# EAGLE schematic RHB0032E.pac (EAGLE 9.6.2)
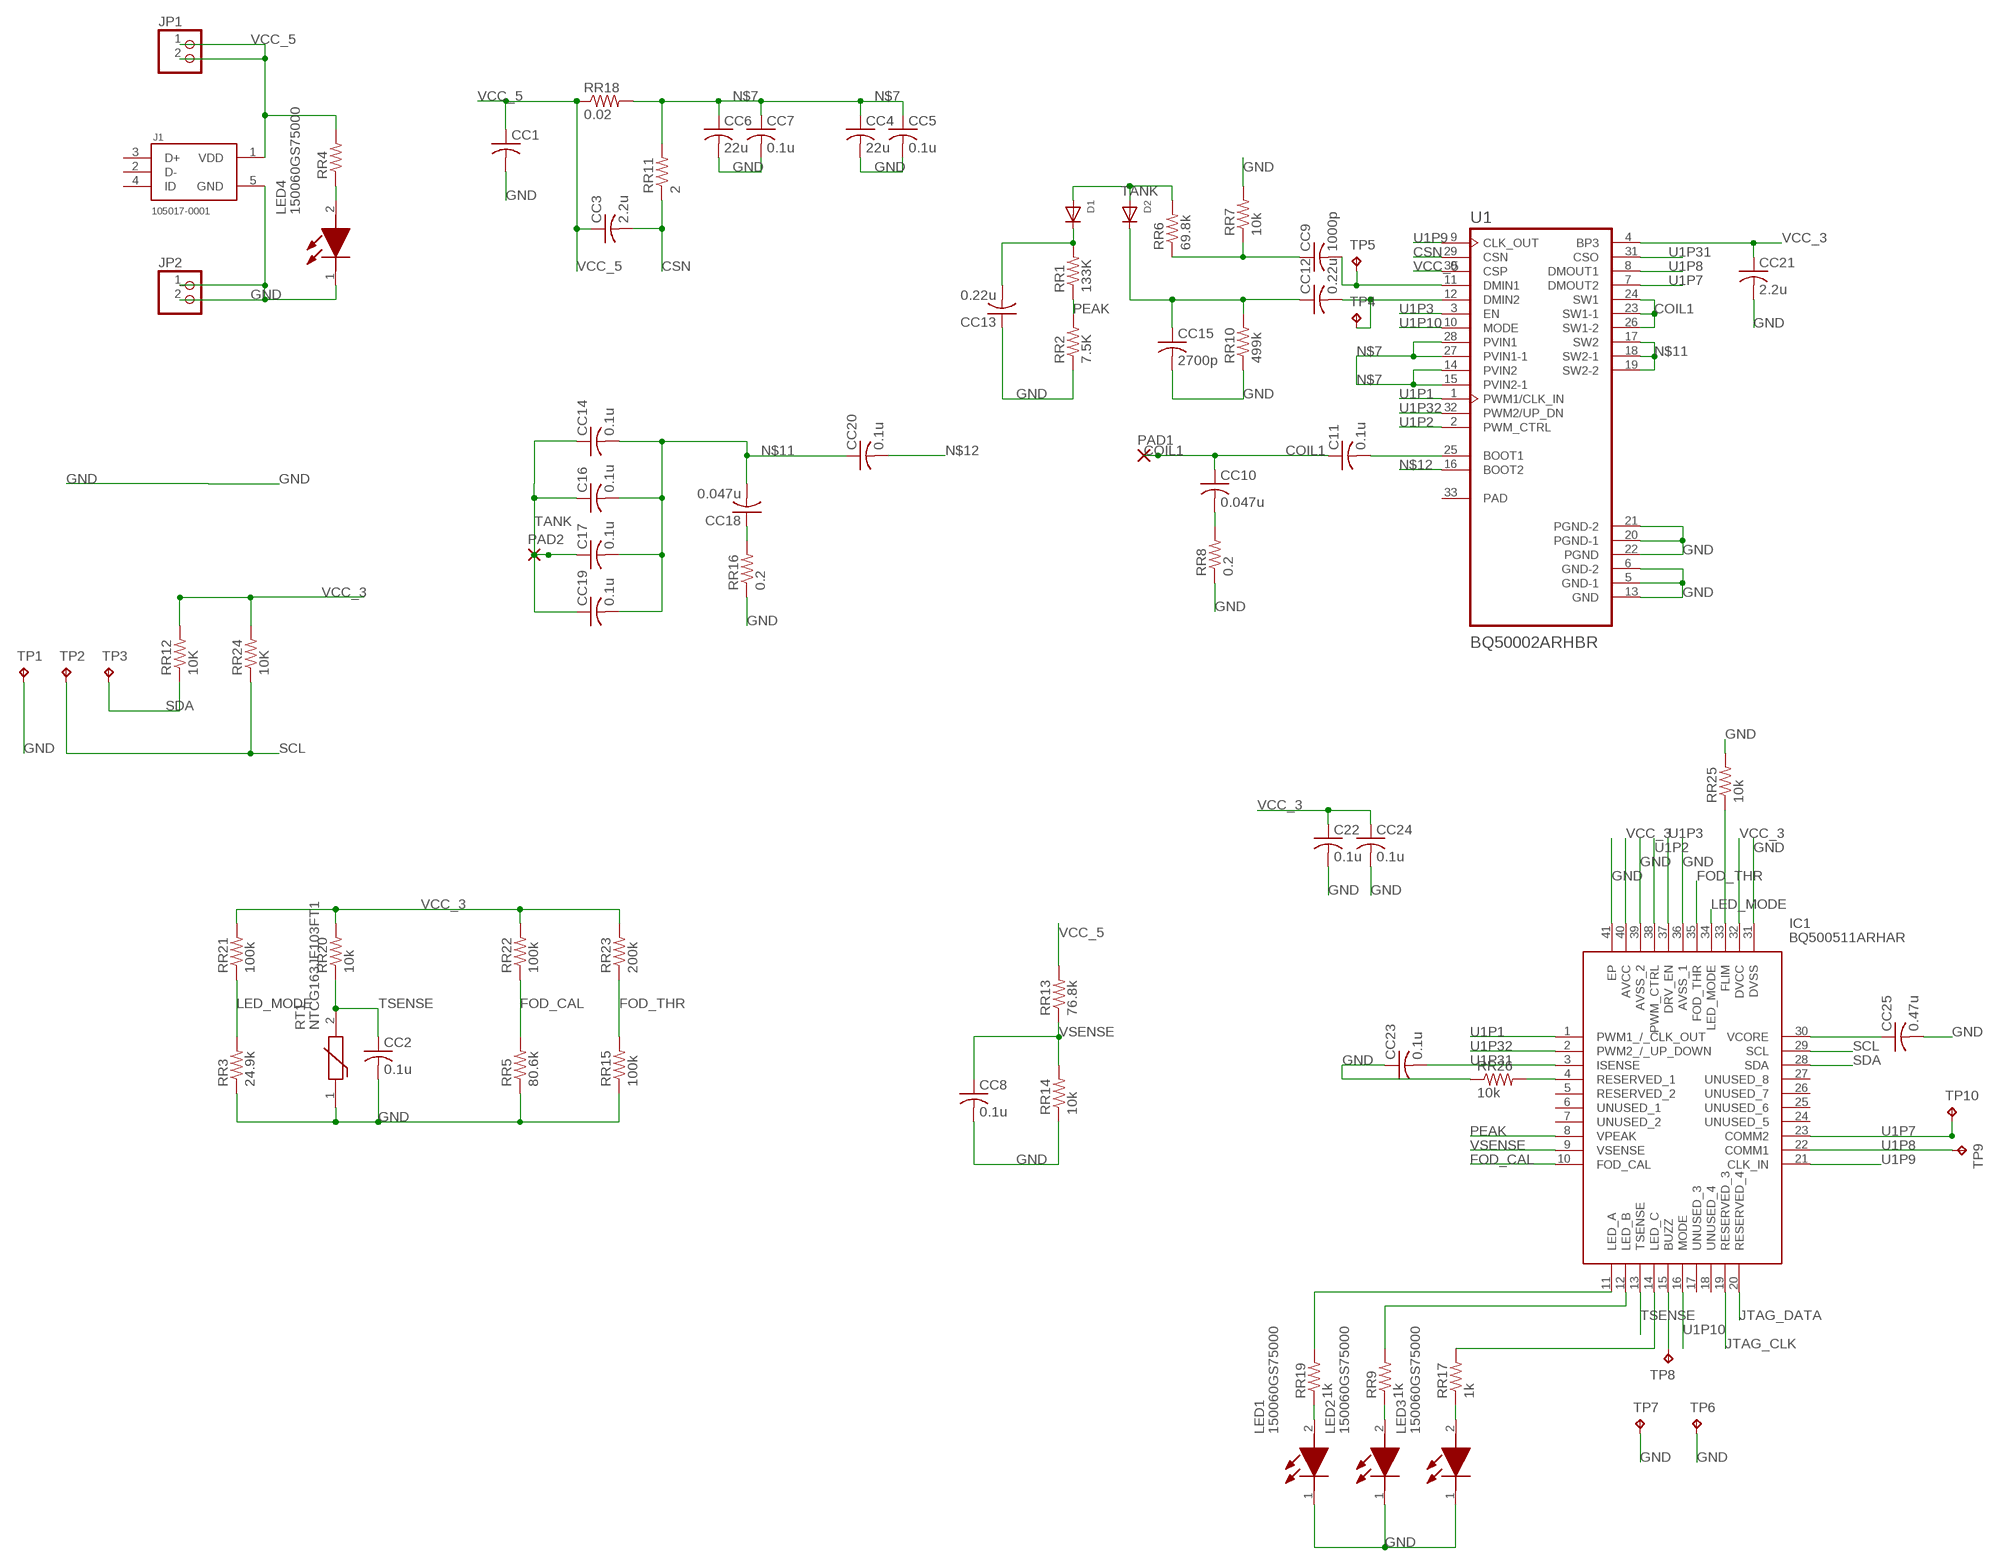
[diagram p0: schematic, sheet 1]

## Parts
C11  0.1u  C-USC0402  [C0402]
C16  0.1u  C-USC0402  [C0402]
C17  0.1u  C-USC0402  [C0402]
C22  0.1u  C-USC0402  [C0402]
CC1  C-USC0402  [C0402]
CC2  0.1u  C-USC0402  [C0402]
CC3  2.2u  C-USC0402  [C0402]
CC4  22u  C-USC0402  [C0402]
CC5  0.1u  C-USC0402  [C0402]
CC6  22u  C-USC0402  [C0402]
CC7  0.1u  C-USC0402  [C0402]
CC8  0.1u  C-USC0402  [C0402]
CC9  1000p  C-USC0402  [C0402]
CC10  0.047u  C-USC0402  [C0402]
CC12  0.22u  C-USC0402  [C0402]
CC13  0.22u  C-USC0402  [C0402]
CC14  0.1u  C-USC0402  [C0402]
CC15  2700p  C-USC0402  [C0402]
CC18  0.047u  C-USC0402  [C0402]
CC19  0.1u  C-USC0402  [C0402]
CC20  0.1u  C-USC0402  [C0402]
CC21  2.2u  C-USC0402  [C0402]
CC23  0.1u  C-USC0402  [C0402]
CC24  0.1u  C-USC0402  [C0402]
CC25  0.47u  C-USC0402  [C0402]
D1  DIODESOD-523  [SOD-523]
D2  DIODESOD-523  [SOD-523]
IC1  BQ500511ARHAR  [QFN50P600X600X100-41N]
J1  105017-0001  [MOLEX_105017-0001]
JP1  PINHD-1X2  [1X02]
JP2  PINHD-1X2  [1X02]
LED1  150060GS75000  [LEDC1608X80N]
LED2  150060GS75000  [LEDC1608X80N]
LED3  150060GS75000  [LEDC1608X80N]
LED4  150060GS75000  [LEDC1608X80N]
PAD1  SMD2  [SMD1,27-2,54]
PAD2  SMD2  [SMD1,27-2,54]
RR1  133K  R-US_R0603  [R0603]
RR2  7.5K  R-US_R0603  [R0603]
RR3  24.9k  R-US_R0603  [R0603]
RR4  R-US_R0603  [R0603]
RR5  80.6k  R-US_R0603  [R0603]
RR6  69.8k  R-US_R0603  [R0603]
RR7  10k  R-US_R0603  [R0603]
RR8  0.2  R-US_R0603  [R0603]
RR9  1k  R-US_R0603  [R0603]
RR10  499k  R-US_R0603  [R0603]
RR11  2  R-US_R0603  [R0603]
RR12  10K  R-US_R0603  [R0603]
RR13  76.8k  R-US_R0603  [R0603]
RR14  10k  R-US_R0603  [R0603]
RR15  100k  R-US_R0603  [R0603]
RR16  0.2  R-US_R0603  [R0603]
RR17  1k  R-US_R0603  [R0603]
RR18  0.02  R-US_R0603  [R0603]
RR19  1k  R-US_R0603  [R0603]
RR20  10k  R-US_R0603  [R0603]
RR21  100k  R-US_R0603  [R0603]
RR22  100k  R-US_R0603  [R0603]
RR23  200k  R-US_R0603  [R0603]
RR24  10K  R-US_R0603  [R0603]
RR25  10k  R-US_R0603  [R0603]
RR26  10k  R-US_R0603  [R0603]
RT1  NTCG163JF103FT1  [THRMC1608X90N]
TP1  TPPAD1-13  [P1-13]
TP2  TPPAD1-13  [P1-13]
TP3  TPPAD1-13  [P1-13]
TP4  TPPAD1-13  [P1-13]
TP5  TPPAD1-13  [P1-13]
TP6  TPPAD1-13  [P1-13]
TP7  TPPAD1-13  [P1-13]
TP8  TPPAD1-13  [P1-13]
TP9  TPPAD1-13  [P1-13]
TP10  TPPAD1-13  [P1-13]
U1  BQ50002ARHBR  [IC_ADS125H01IRHBT]

## Nets
COIL1: C11.1 CC10.1 PAD1.1(P) U1.23(SW1-1) U1.24(SW1) U1.26(SW1-2)
CSN: CC3.2 RR11.1 U1.29(CSN)
FOD_CAL: IC1.10(FOD_CAL) RR5.2 RR22.1
FOD_THR: IC1.35(FOD_THR) RR15.2 RR23.1
GND: C22.2 CC1.2 CC2.2 CC4.2 CC5.2 CC6.2 CC7.2 CC8.2 CC13.1 CC15.2 CC21.2 CC23.1 CC24.2 CC25.2 IC1.31(DVSS) IC1.36(AVSS_1) IC1.39(AVSS_2) IC1.41(EP) J1.5(GND) JP2.1 JP2.2 LED1.1(K) LED2.1(K) LED3.1(K) LED4.1(K) RR2.1 RR3.1 RR5.1 RR7.2 RR8.1 RR10.1 RR14.1 RR15.1 RR16.1 RR25.2 RR26.1 RT1.1 TP1.TP TP6.TP TP7.TP U1.5(GND-1) U1.6(GND-2) U1.13(GND) U1.20(PGND-1) U1.21(PGND-2) U1.22(PGND)
JTAG_CLK: IC1.19(RESERVED_3)
JTAG_DATA: IC1.20(RESERVED_4)
LED_MODE: IC1.34(LED_MODE) RR3.2 RR21.1
N$1: CC12.2 TP4.TP U1.12(DMIN2)
N$2: CC12.1 CC15.1 D2.K(C) RR10.2
N$4: CC13.2 D1.K(C) RR1.2
N$5: CC9.2 TP5.TP U1.11(DMIN1)
N$6: CC9.1 RR6.1 RR7.1
N$7: CC4.1 CC5.1 CC6.1 CC7.1 RR11.2 RR18.2 U1.14(PVIN2) U1.15(PVIN2-1) U1.27(PVIN1-1) U1.28(PVIN1)
N$8: IC1.15(BUZZ) TP8.TP
N$9: C11.2 U1.25(BOOT1)
N$10: CC10.2 RR8.2
N$11: C16.2 C17.2 CC14.2 CC18.2 CC19.2 CC20.1 U1.17(SW2) U1.18(SW2-1) U1.19(SW2-2)
N$12: CC20.2 U1.16(BOOT2)
N$13: CC25.1 IC1.30(VCORE)
N$14: LED1.2(A) RR19.1
N$15: CC18.1 RR16.2
N$16: LED2.2(A) RR9.1
N$17: LED3.2(A) RR17.1
N$18: IC1.33(FLIM) RR25.1
N$19: IC1.11(LED_A) RR19.2
N$20: IC1.12(LED_B) RR9.2
N$21: IC1.14(LED_C) RR17.2
N$22: IC1.4(RESERVED_1) RR26.2
N$23: LED4.2(A) RR4.1
PEAK: IC1.8(VPEAK) RR1.1 RR2.2
SCL: IC1.29(SCL) RR24.1 TP2.TP
SDA: IC1.28(SDA) RR12.1 TP3.TP
TANK: C16.1 C17.1 CC14.1 CC19.1 D1.A D2.A PAD2.1(P) RR6.2
TSENSE: CC2.1 IC1.13(TSENSE) RR20.1 RT1.2
U1P1: IC1.1(PWM1_/_CLK_OUT) U1.1(PWM1/CLK_IN)
U1P2: IC1.38(PWM_CTRL) U1.2(PWM_CTRL)
U1P3: IC1.37(DRV_EN) U1.3(EN)
U1P7: IC1.23(COMM2) TP10.TP U1.7(DMOUT2)
U1P8: IC1.22(COMM1) TP9.TP U1.8(DMOUT1)
U1P9: IC1.21(CLK_IN) U1.9(CLK_OUT)
U1P10: IC1.16(MODE) U1.10(MODE)
U1P31: CC23.2 IC1.3(ISENSE) U1.31(CSO)
U1P32: IC1.2(PWM2_/_UP_DOWN) U1.32(PWM2/UP_DN)
VCC_3: C22.1 CC21.1 CC24.1 IC1.32(DVCC) IC1.40(AVCC) RR12.2 RR20.2 RR21.2 RR22.2 RR23.2 RR24.2 U1.4(BP3)
VCC_5: CC1.1 CC3.1 J1.1(VDD) JP1.1 JP1.2 RR4.2 RR13.2 RR18.1 U1.30(CSP)
VSENSE: CC8.1 IC1.9(VSENSE) RR13.1 RR14.2
Unconnected: IC1.5(RESERVED_2) IC1.6(UNUSED_1) IC1.7(UNUSED_2) IC1.17(UNUSED_3) IC1.18(UNUSED_4) IC1.24(UNUSED_5) IC1.25(UNUSED_6) IC1.26(UNUSED_7) IC1.27(UNUSED_8) J1.2(D-) J1.3(D+) J1.4(ID) U1.33(PAD)

## Library data of the parts
C11 C16 C17 C22 CC1-CC10 CC12-CC15 CC18-CC21 CC23-CC25 = adafruit:C-US: CAPACITOR, American symbol
D1 D2 = adafruit:DIODE: Diode SMADIODE - SMA Surface Mount Package 20V 1A Schottky Diode Digikey: 641-1014-6-ND DO-1N4148 - Through Hole Small Current Diode SOD-123 20V 1 A (.5mV Vf) Schottky Diode - Digikey: MBRX120TPMSCT-ND SOD-323 10V 570mA (.38mV Vf, 3ns) Schottky Diode - Digikey: ZLLS410CT-ND SOD-523 30V 30mA Schottky Diode (RB751S-40TE61) - Digikey: RB751S-40TE61CT-ND SOT23-R/W - SOT23 Package (R = Solder Paste/Reflow Ovens, W = Hand-Soldering) BAT54Film 40V 300mA - Digikey: 497-7162-1-ND
IC1 = BQ500511ARHAR:BQ500511ARHAR: Wireless Charging ICs Wireless Power Transmitter Controller 40-VQFN -40 to 85 Source: Datasheet <http://www.ti.com/lit/ds/symlink/bq500511a.pdf>; DESCRIPTION: Wireless Charging ICs Wireless Power Transmitter Controller 40-VQFN -40 to 85; HEIGHT: 1mm; MANUFACTURER_NAME: Texas Instruments; MANUFACTURER_PART_NUMBER: BQ500511ARHAR; MOUSER_PART_NUMBER: 595-BQ500511ARHAR; MOUSER_PRICE-STOCK: https://www.mouser.co.uk/ProductDetail/Texas-Instruments/BQ500511ARHAR?qs=LuYMPh7GGMTHLnf6Ooavlw%3D%3D
J1 = 105017-0001:105017-0001: Check availability <https://pricing.snapeda.com/parts/105017-0001/Molex/view-part?ref=eda>; AVAILABILITY: In Stock; DESCRIPTION: USB - micro B USB 2.0 Receptacle Connector 5 Position Surface Mount, Right Angle; Through Hole; MF: Molex; MP: 105017-0001; PACKAGE: None; PRICE: None; PURCHASE-URL: https://pricing.snapeda.com/search/part/105017-0001/?ref=eda
JP1 JP2 = pinhead:PINHD-1X2: PIN HEADER
LED1-LED4 = 150060GS75000:150060GS75000: Wurth Elektronik WL-SMCW 520 nm Green LED, 1608 (0603) Clear SMD package Source: Datasheet <https://componentsearchengine.com/Datasheets/2/150060GS75000.pdf>; DESCRIPTION: Wurth Elektronik WL-SMCW 520 nm Green LED, 1608 (0603) Clear SMD package; HEIGHT: 0.8mm; MANUFACTURER_NAME: Wurth Elektronik; MANUFACTURER_PART_NUMBER: 150060GS75000; MOUSER_PART_NUMBER: 710-150060GS75000; MOUSER_PRICE-STOCK: https://www.mouser.co.uk/ProductDetail/Wurth-Elektronik/150060GS75000?qs=LlUlMxKIyB0UYkq5lDO8nA%3D%3D
PAD1 PAD2 = wirepad:SMD2: SMD PAD
RR1-RR26 = adafruit:R-US_: RESISTOR, American symbol
RT1 = NTCG163JF103FT1:NTCG163JF103FT1: Chip NTC Thermistors (Sensor), Resistance (at 25?C)=10k?, Resistance Tolerance (at 25?C)=?1% Source: Datasheet <https://product.tdk.com/system/files/dam/doc/product/sensor/ntc/chip-ntc-thermistor/catalog/tpd_commercial_ntc-thermistor_ntcg_en.pdf>; DESCRIPTION: Chip NTC Thermistors (Sensor), Resistance (at 25?C)=10k?, Resistance Tolerance (at 25?C)=?1%; HEIGHT: 0.9mm; MANUFACTURER_NAME: TDK; MANUFACTURER_PART_NUMBER: NTCG163JF103FT1; MOUSER_PART_NUMBER: 810-NTCG163JF103FT1; MOUSER_PRICE-STOCK: https://www.mouser.co.uk/ProductDetail/TDK/NTCG163JF103FT1?qs=f0gCvUGw%252BIyUP%2FT8hD9VGA%3D%3D
TP1-TP10 = testpad:TP: Test pad
U1 = BQ50002ARHBR:BQ50002ARHBR: Check availability <https://pricing.snapeda.com/parts/BQ50002ARHBR/Texas%20Instruments/view-part?ref=eda>; AVAILABILITY: In Stock; DESCRIPTION: Low-Cost 5-V Wireless Power Transmitter AFE WPC V 1.2 A11 Transmitter 32-VQFN -40 to 125; MF: Texas Instruments; MP: BQ50002ARHBR; PACKAGE: VQFN-32 Texas Instruments; PRICE: None; PURCHASE-URL: https://pricing.snapeda.com/search/part/BQ50002ARHBR/?ref=eda